# Altium schematic sheet LEDSandButtons.SchDoc
size A; DocumentNumber: 8; SheetNumber: 8; SheetTotal: 8
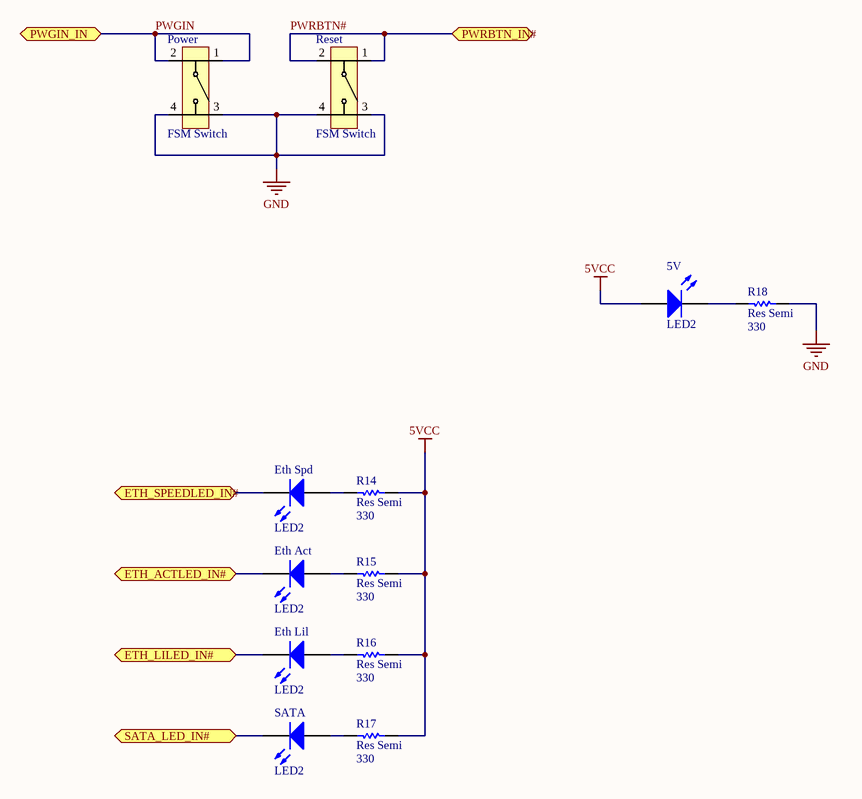
[diagram p0: LEDSandButtons.SchDoc]

## Parts
5V  LED2  [C0805]
Eth_Act  LED2  [C0805]
Eth_Lil  LED2  [C0805]
Eth_Spd  LED2  [C0805]
Power  FSM Switch  [FSM4JH]
R14  Res Semi  value 330  [1005[0402]]
R15  Res Semi  value 330  [1005[0402]]
R16  Res Semi  value 330  [1005[0402]]
R17  Res Semi  value 330  [1005[0402]]
R18  Res Semi  value 330  [1005[0402]]
Reset  FSM Switch  [FSM4JH]
SATA  LED2  [C0805]

## Ports
ETH_ACTLED_IN#, ETH_LILED_IN#, ETH_SPEEDLED_IN#, PWGIN_IN, PWRBTN_IN#, SATA_LED_IN#

## Nets
5VCC: 5V.1(A) R14.1 R15.1 R16.1 R17.1
GND: Power.3 Power.4 R18.1 Reset.3 Reset.4
ETH_ACTLED_IN#: Eth_Act.2(K) ; port ETH_ACTLED_IN#
ETH_LILED_IN#: Eth_Lil.2(K) ; port ETH_LILED_IN#
ETH_SPEEDLED_IN#: Eth_Spd.2(K) ; port ETH_SPEEDLED_IN#
PWGIN: Power.1 Power.2 ; port PWGIN_IN
PWRBTN#: Reset.1 Reset.2 ; port PWRBTN_IN#
SATA_LED_IN#: SATA.2(K) ; port SATA_LED_IN#
Net5V_2: 5V.2(K) R18.2
NetEth_Act_1: Eth_Act.1(A) R15.2
NetEth_Lil_1: Eth_Lil.1(A) R16.2
NetEth_Spd_1: Eth_Spd.1(A) R14.2
NetR17_2: R17.2 SATA.1(A)

## Library data of the parts
5V Eth_Act Eth_Lil Eth_Spd SATA = LED2: Typical RED, GREEN, YELLOW, AMBER GaAs LED; Published: 8-Jun-2000; LatestRevisionDate: 17-Jul-2002; LatestRevisionNote: Re-released for DXP Platform.; PackageDocument: Feb-2002; PackageReference: 3.2X1.6X1.1; Publisher: Altium Limited
Power Reset = FSM Switch: FSM 6mm Series Switch
R14-R18 = Res Semi: Semiconductor Resistor; Published: 8-Jun-2000; LatestRevisionDate: 17-Jul-2002; LatestRevisionNote: Re-released for DXP Platform.; PackageReference: AXIAL-0.5; Publisher: Altium Limited